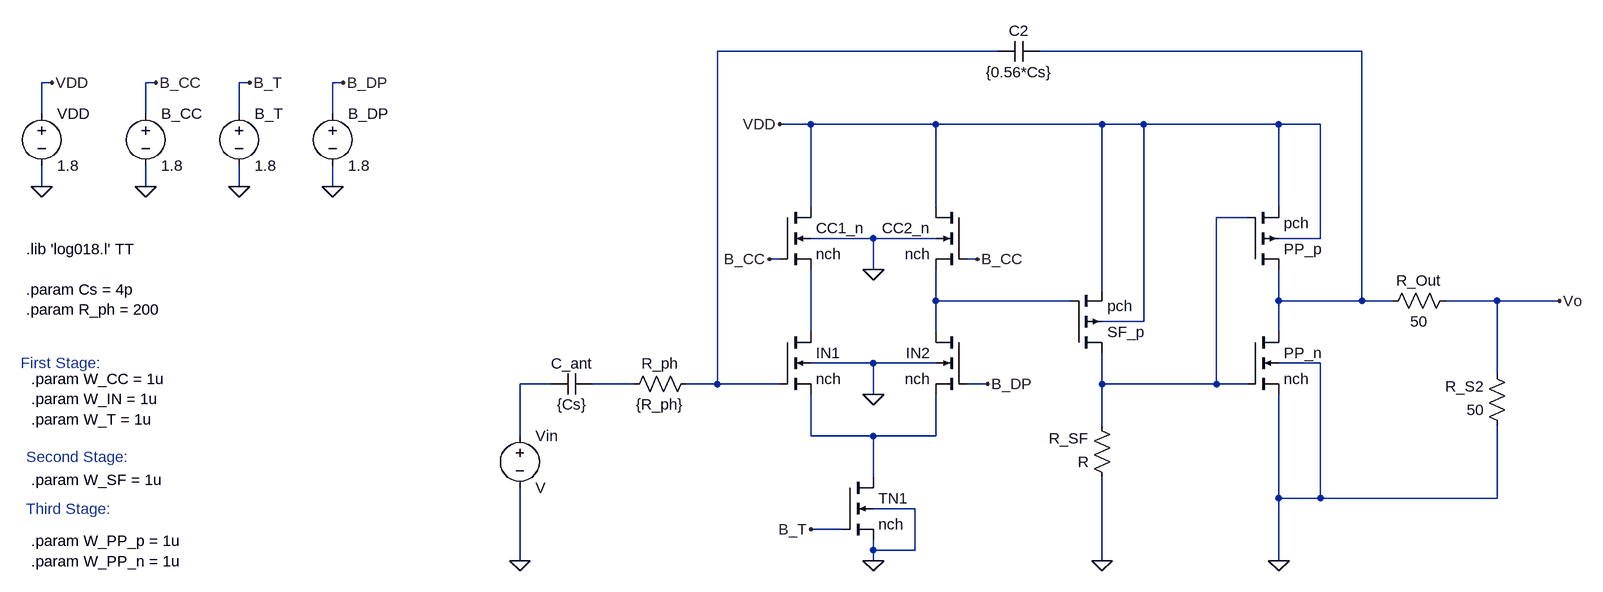
[diagram p0: schematic SED_LT_SIM.asc]
SED_LT_SIM.asc, the LTspice schematic file:
Version 4
SHEET 1 2736 680
WIRE 880 -160 448 -160
WIRE 1440 -160 944 -160
WIRE -576 -112 -592 -112
WIRE -416 -112 -432 -112
WIRE -272 -112 -288 -112
WIRE -128 -112 -144 -112
WIRE -592 -64 -592 -112
WIRE -432 -64 -432 -112
WIRE -288 -64 -288 -112
WIRE -144 -64 -144 -112
WIRE 592 -48 544 -48
WIRE 784 -48 592 -48
WIRE 1040 -48 784 -48
WIRE 1104 -48 1040 -48
WIRE 1312 -48 1104 -48
WIRE 1376 -48 1312 -48
WIRE -592 48 -592 16
WIRE -432 48 -432 16
WIRE -288 48 -288 16
WIRE -144 48 -144 16
WIRE 592 80 592 -48
WIRE 784 80 784 -48
WIRE 1312 80 1312 -48
WIRE 1264 96 1216 96
WIRE 688 128 592 128
WIRE 784 128 688 128
WIRE 1376 128 1376 -48
WIRE 1376 128 1312 128
WIRE 544 160 528 160
WIRE 848 160 832 160
WIRE 688 176 688 128
WIRE 1040 208 1040 -48
WIRE 784 224 784 176
WIRE 992 224 784 224
WIRE 1312 224 1312 176
WIRE 1440 224 1440 -160
WIRE 1440 224 1312 224
WIRE 1488 224 1440 224
WIRE 1648 224 1568 224
WIRE 1744 224 1648 224
WIRE 1104 256 1104 -48
WIRE 1104 256 1040 256
WIRE 592 272 592 176
WIRE 784 272 784 224
WIRE 1312 272 1312 224
WIRE 688 320 592 320
WIRE 784 320 688 320
WIRE 1376 320 1312 320
WIRE 1648 336 1648 224
WIRE 192 352 144 352
WIRE 320 352 256 352
WIRE 448 352 448 -160
WIRE 448 352 400 352
WIRE 544 352 448 352
WIRE 864 352 832 352
WIRE 1040 352 1040 304
WIRE 1216 352 1216 96
WIRE 1216 352 1040 352
WIRE 1264 352 1216 352
WIRE 688 368 688 320
WIRE 1040 416 1040 352
WIRE 144 432 144 352
WIRE 592 432 592 368
WIRE 688 432 592 432
WIRE 784 432 784 368
WIRE 784 432 688 432
WIRE 688 496 688 432
WIRE 1312 528 1312 368
WIRE 1376 528 1376 320
WIRE 1376 528 1312 528
WIRE 1648 528 1648 416
WIRE 1648 528 1376 528
WIRE 752 544 688 544
WIRE 640 576 592 576
WIRE 688 608 688 592
WIRE 752 608 752 544
WIRE 752 608 688 608
WIRE 144 624 144 512
WIRE 688 624 688 608
WIRE 1040 624 1040 496
WIRE 1312 624 1312 528
FLAG 688 368 0
FLAG 688 624 0
FLAG 1312 624 0
FLAG 144 624 0
FLAG 688 176 0
FLAG -592 48 0
FLAG -576 -112 VDD
FLAG 544 -48 VDD
FLAG -432 48 0
FLAG -416 -112 B_CC
FLAG 848 160 B_CC
FLAG 528 160 B_CC
FLAG -288 48 0
FLAG -272 -112 B_T
FLAG 592 576 B_T
FLAG -144 48 0
FLAG -128 -112 B_DP
FLAG 864 352 B_DP
FLAG 1040 624 0
FLAG 1744 224 Vo
SYMBOL nmos4 640 496 R0
SYMATTR InstName TN1
SYMATTR Value nch
SYMATTR Value2 l=0.18u w={W_T}
SYMBOL nmos4 544 272 R0
SYMATTR InstName IN1
SYMATTR Value nch
SYMATTR Value2 l=0.18u w={W_IN}
SYMBOL nmos4 832 272 M0
SYMATTR InstName IN2
SYMATTR Value nch
SYMATTR Value2 l=0.18u w={W_IN}
SYMBOL pmos4 992 304 M180
SYMATTR InstName SF_p
SYMATTR Value pch
SYMATTR Value2 l=0.18u w={W_SF}
SYMBOL pmos4 1264 176 M180
SYMATTR InstName PP_p
SYMATTR Value pch
SYMATTR Value2 l=0.18u w={W_PP_p}
SYMBOL nmos4 1264 272 R0
SYMATTR InstName PP_n
SYMATTR Value nch
SYMATTR Value2 l=0.18u w={W_PP_n}
SYMBOL res 416 336 R90
WINDOW 0 0 56 VBottom 2
WINDOW 3 32 56 VTop 2
SYMATTR InstName R_ph
SYMATTR Value {R_ph}
SYMBOL res 1584 208 R90
WINDOW 0 0 56 VBottom 2
WINDOW 3 32 56 VTop 2
SYMATTR InstName R_Out
SYMATTR Value 50
SYMBOL res 1664 432 R180
WINDOW 0 36 76 Left 2
WINDOW 3 36 40 Left 2
SYMATTR InstName R_S2
SYMATTR Value 50
SYMBOL voltage 144 416 R0
SYMATTR InstName Vin
SYMBOL cap 256 336 R90
WINDOW 0 0 32 VBottom 2
WINDOW 3 32 32 VTop 2
SYMATTR InstName C_ant
SYMATTR Value {Cs}
SYMBOL nmos4 544 80 R0
SYMATTR InstName CC1_n
SYMATTR Value nch
SYMATTR Value2 l=0.18u w={W_CC}
SYMBOL nmos4 832 80 M0
SYMATTR InstName CC2_n
SYMATTR Value nch
SYMATTR Value2 l=0.18u w={W_CC}
SYMBOL cap 944 -176 R90
WINDOW 0 0 32 VBottom 2
WINDOW 3 32 32 VTop 2
SYMATTR InstName C2
SYMATTR Value {0.56*Cs}
SYMBOL voltage -592 -80 R0
WINDOW 123 0 0 Left 0
WINDOW 39 0 0 Left 0
SYMATTR InstName VDD
SYMATTR Value 1.8
SYMBOL voltage -432 -80 R0
WINDOW 123 0 0 Left 0
WINDOW 39 0 0 Left 0
SYMATTR InstName B_CC
SYMATTR Value 1.8
SYMBOL voltage -288 -80 R0
WINDOW 123 0 0 Left 0
WINDOW 39 0 0 Left 0
SYMATTR InstName B_T
SYMATTR Value 1.8
SYMBOL voltage -144 -80 R0
WINDOW 123 0 0 Left 0
WINDOW 39 0 0 Left 0
SYMATTR InstName B_DP
SYMATTR Value 1.8
SYMBOL res 1056 512 R180
WINDOW 0 36 76 Left 2
WINDOW 3 36 40 Left 2
SYMATTR InstName R_SF
TEXT -616 144 Left 2 !.lib 'log018.l' TT\n \n.param Cs = 4p\n.param R_ph = 200
TEXT -608 344 Left 2 !.param W_CC = 1u\n.param W_IN = 1u\n.param W_T = 1u\n \n \n.param W_SF = 1u\n \n \n.param W_PP_p = 1u\n.param W_PP_n = 1u
TEXT -624 320 Left 2 ;First Stage:
TEXT -616 464 Left 2 ;Second Stage:
TEXT -616 544 Left 2 ;Third Stage:

The netlist it stands for:
* SED_LT_SIM.asc
M§TN1 N008 B_T 0 0 nch l=0.18u w={W_T}
M§IN1 N005 N001 N008 0 nch l=0.18u w={W_IN}
M§IN2 N004 B_DP N008 0 nch l=0.18u w={W_IN}
M§SF_p N003 N004 VDD VDD pch l=0.18u w={W_SF}
M§PP_p N002 N003 VDD VDD pch l=0.18u w={W_PP_p}
M§PP_n N002 N003 0 0 nch l=0.18u w={W_PP_n}
R_ph N001 N007 {R_ph}
R_Out Vo N002 50
R_S2 0 Vo 50
Vin N006 0 V
C_ant N007 N006 {Cs}
M§CC1_n VDD B_CC N005 0 nch l=0.18u w={W_CC}
M§CC2_n VDD B_CC N004 0 nch l=0.18u w={W_CC}
C2 N002 N001 {0.56*Cs}
VDD VDD 0 1.8
V§B_CC B_CC 0 1.8
V§B_T B_T 0 1.8
V§B_DP B_DP 0 1.8
R_SF 0 N003 R
.model NMOS NMOS
.model PMOS PMOS
.lib standard.mos
.lib 'log018.l' TT
.param Cs = 4p
.param R_ph = 200
.param W_CC = 1u
.param W_IN = 1u
.param W_T = 1u
.param W_SF = 1u
.param W_PP_p = 1u
.param W_PP_n = 1u
* First Stage:
* Second Stage:
* Third Stage:
.backanno
.end